# EasyEDA schematic SCH_transmitter.json
TITLE: Sheet_1; REV: 1.0; Date: 2024-06-21; Sheet: 1/1; Drawn By: liketoengineer; Company: Your Company
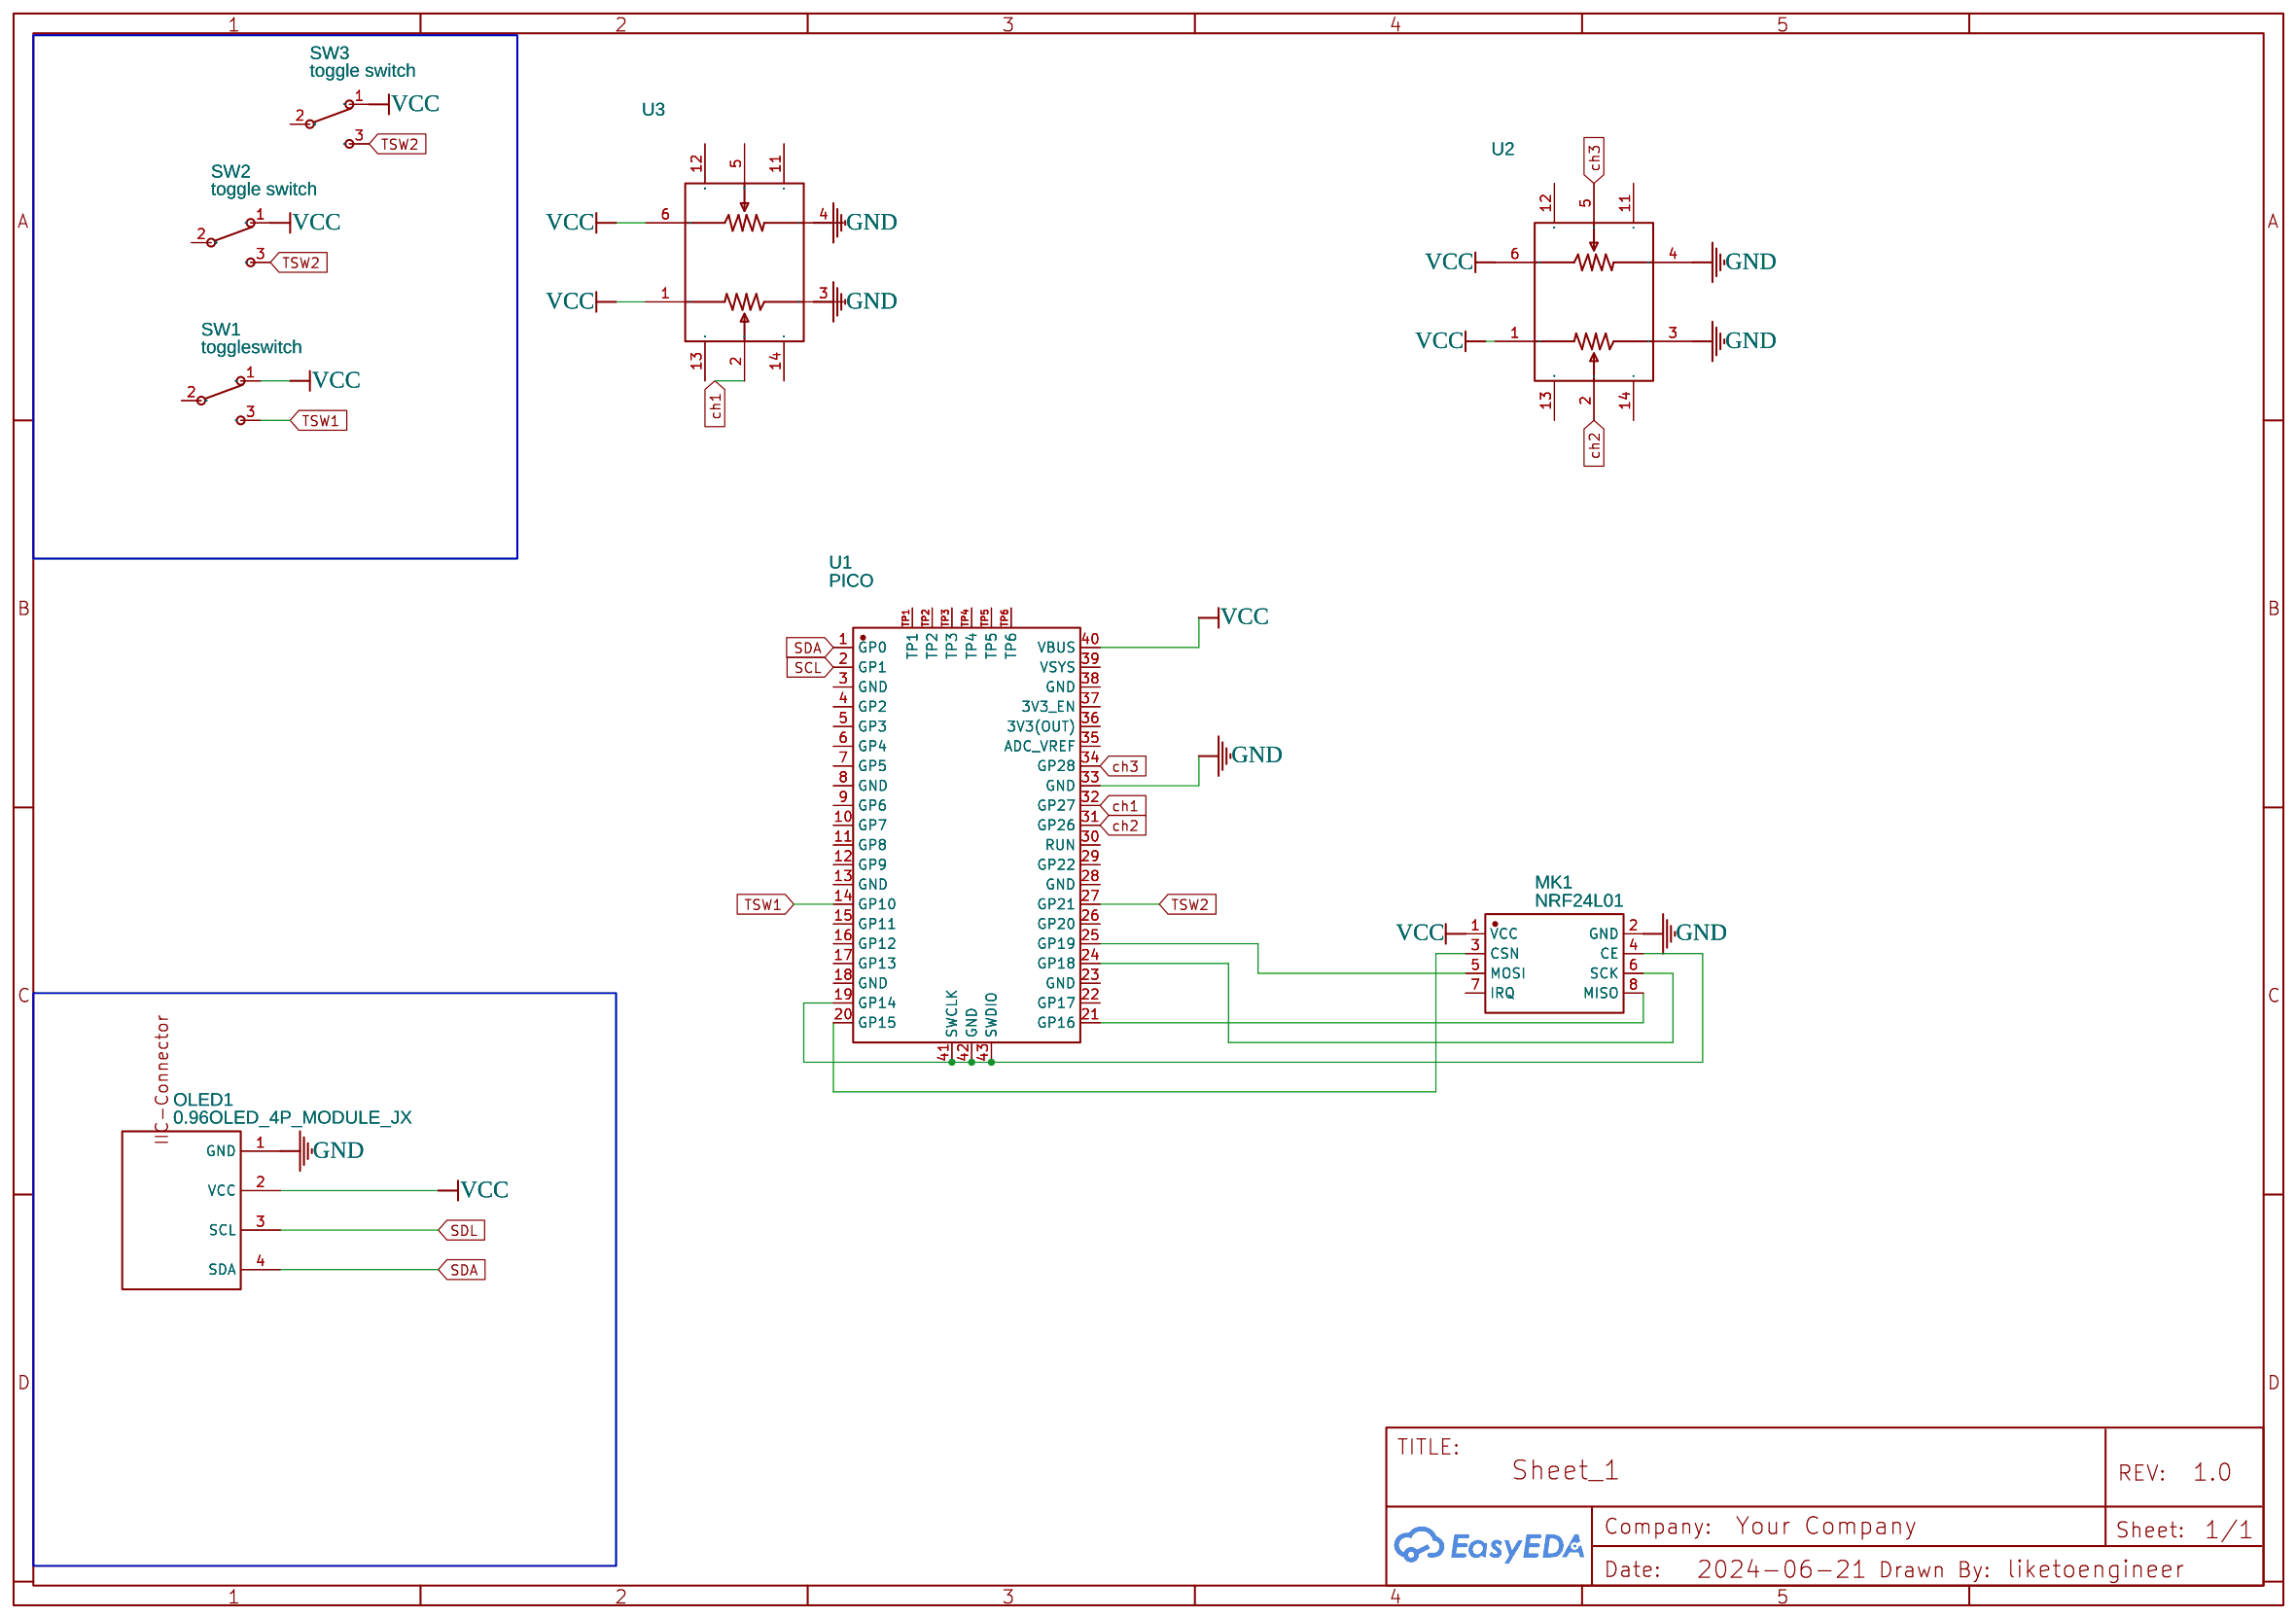
[diagram p0: schematic sheet]

## Parts
MK1  NRF24L01  [WIRELM-SMD_NRF24L01]
OLED1  0.96OLED_4P_MODULE_JX  [0.96OLED_4P]
SW1  toggleswitch  [SW-TH_L12.7-W6.9-P4.70_TOGGLESWITCH7102]
SW2  toggle switch  [SW-TH_L12.7-W6.9-P4.70_TOGGLESWITCH7102]
SW3  toggle switch  [SW-TH_L12.7-W6.9-P4.70_TOGGLESWITCH7102]
U1  PICO  [COMM-SMD_L51.0-W21.0-P2.54_SC0916]
U2  252A103B60NA  [JOYSTICK-TH_252BXXXXXXXA]
U3  252A103B60NA  [JOYSTICK-TH_252BXXXXXXXA]

## Library data of the parts
MK1 = NRF24L01: Supplier: LCSC; Manufacturer: Ai-Thinker(安信可); Manufacturer Part: NF-04; Supplier Part: C90751; JLCPCB Part Class: Extended Part
OLED1 = 0.96OLED_4P_MODULE_JX: Contributor: LCSC; Supplier: LCSC; Supplier Part: C9900004566; Manufacturer: null
SW1-SW3 = 100SP1T2B4M6QE: Contributor: lcsc; Supplier: LCSC; Supplier Part: C4943343; Manufacturer: null; JLCPCB Part Class: Extended Part
U1 = PICO: Supplier: LCSC; Supplier Part: C7203002; Manufacturer: Raspberry Pi(树莓派); JLCPCB Part Class: Extended Part; Contributor: lcsc
U2 U3 = 252A103B60NA: Supplier: LCSC; Supplier Part: C19376001; Manufacturer: CTS(西迪斯); Contributor: lcsc

## Nets
GND: MK1.2(GND) OLED1.1(GND) U1.33(GND) U2.3 U2.4 U3.3 U3.4
VCC: MK1.1(VCC) OLED1.2(VCC) SW1.1(ON) SW2.1(ON) SW3.1(ON) U1.40(VBUS) U2.1 U2.6 U3.1 U3.6
ch1: U1.32(GP27) U3.2
ch2: U1.31(GP26) U2.2
ch3: U1.34(GP28) U2.5
SCL: U1.2(GP1)
SDA: OLED1.4(SDA) U1.1(GP0)
SDL: OLED1.3(SCL)
TSW1: SW1.3(NC) U1.14(GP10)
TSW2: SW2.3(NC) SW3.3(NC) U1.27(GP21)
Net-(MK1-3): MK1.3(CSN) U1.20(GP15)
Net-(MK1-4): MK1.4(CE) U1.19(GP14) U1.41(SWCLK) U1.42(GND) U1.43(SWDIO)
Net-(MK1-5): MK1.5(MOSI) U1.25(GP19)
Net-(MK1-6): MK1.6(SCK) U1.24(GP18)
Net-(MK1-8): MK1.8(MISO) U1.21(GP16)

Not connected (* = marked no-connect by the designer): MK1 7(IRQ); SW1 2(COMM); SW2 2(COMM); SW3 2(COMM); U1 3(GND) 4(GP2) 5(GP3) 6(GP4) 7(GP5) 8(GND) 9(GP6) 10(GP7) 11(GP8) 12(GP9) 13(GND) 15(GP11) 16(GP12) 17(GP13) 18(GND) 22(GP17) 23(GND) 26(GP20) 28(GND) 29(GP22) 30(RUN) 35(ADC_VREF) 36(3V3(OUT)) 37(3V3_EN) 38(GND) 39(VSYS) TP1 TP2 TP3 TP4 TP5 TP6; U2 11 12 13 14; U3 5 11 12 13 14
